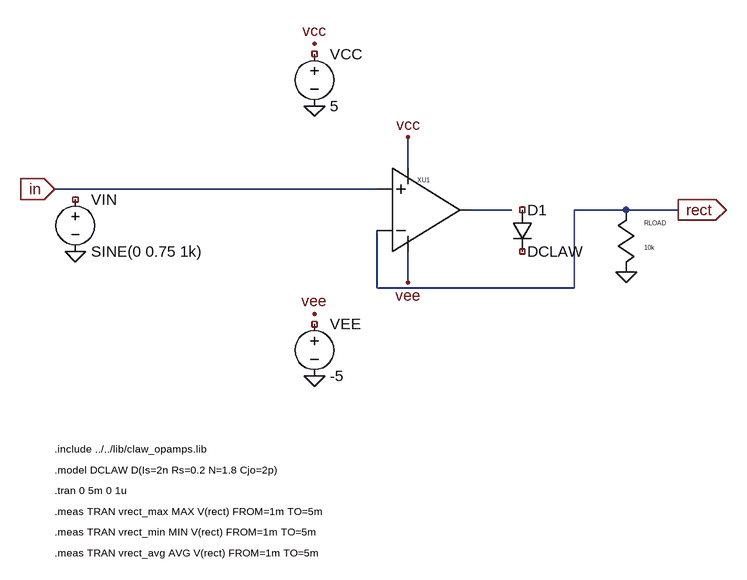
[diagram p0: schematic precision_rectifier.asc]
precision_rectifier.asc, the LTspice schematic file:
Version 4
SHEET 1 1252 1015
WIRE 64 272 560 272
WIRE 704 304 768 304
WIRE 864 304 1024 304
WIRE 864 304 864 424
WIRE 864 424 560 424
WIRE 560 424 560 336
WIRE 608 240 608 192
WIRE 608 368 608 416
SYMBOL voltage 96 272 R0
SYMATTR InstName VIN
SYMATTR Value SINE(0 0.75 1k)
SYMBOL voltage 464 48 R0
SYMATTR InstName VCC
SYMATTR Value 5
SYMBOL voltage 464 464 R0
SYMATTR InstName VEE
SYMATTR Value -5
SYMBOL opamp2 560 240 R0
SYMATTR InstName XU1
SYMATTR Value CLAW_IDEAL_OPAMP
SYMBOL diode 768 304 R0
SYMATTR InstName D1
SYMATTR Value DCLAW
SYMBOL res_v 944 304 R0
SYMATTR InstName RLOAD
SYMATTR Value 10k
FLAG 64 272 in
IOPIN 64 272 In
FLAG 1024 304 rect
IOPIN 1024 304 Out
FLAG 96 368 0
FLAG 944 400 0
FLAG 464 48 vcc
FLAG 464 144 0
FLAG 464 464 vee
FLAG 464 560 0
FLAG 608 192 vcc
FLAG 608 416 vee
TEXT 64 672 Left 1 !.include ../../lib/claw_opamps.lib
TEXT 64 704 Left 1 !.model DCLAW D(Is=2n Rs=0.2 N=1.8 Cjo=2p)
TEXT 64 736 Left 1 !.tran 0 5m 0 1u
TEXT 64 768 Left 1 !.meas TRAN vrect_max MAX V(rect) FROM=1m TO=5m
TEXT 64 800 Left 1 !.meas TRAN vrect_min MIN V(rect) FROM=1m TO=5m
TEXT 64 832 Left 1 !.meas TRAN vrect_avg AVG V(rect) FROM=1m TO=5m

The netlist it stands for:
* precision_rectifier.asc
VIN NC_01 0 SINE(0 0.75 1k)
VCC NC_02 0 5
VEE NC_03 0 -5
XXU1 CLAW_IDEAL_OPAMP CLAW_IDEAL_OPAMP
D1 NC_04 NC_05 DCLAW
RLOAD rect 0 10k
.model D D
.lib standard.dio
.include ../../lib/claw_opamps.lib
.model DCLAW D(Is=2n Rs=0.2 N=1.8 Cjo=2p)
.tran 0 5m 0 1u
.meas TRAN vrect_max MAX V(rect) FROM=1m TO=5m
.meas TRAN vrect_min MIN V(rect) FROM=1m TO=5m
.meas TRAN vrect_avg AVG V(rect) FROM=1m TO=5m
.backanno
.end